# Altium schematic sheet breeze_wireless.SchDoc: Breeze Quadcopter
size A4; Author: myyerrol; Organization: Team MicroDynamics; Address1: NWPU; Address2: Xi'an; Address3: Shannxi; Address4: China; Revision: V0.1; SheetNumber: 5; SheetTotal: 5
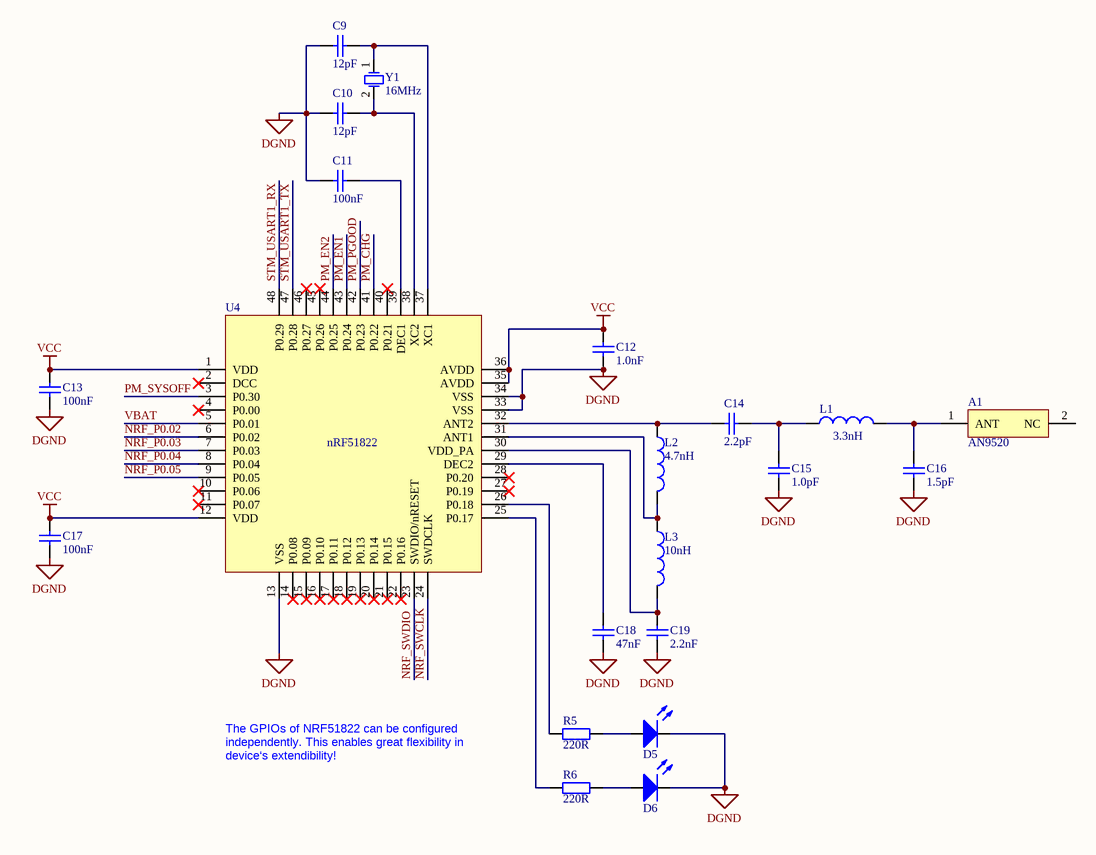
[diagram p0: breeze_wireless.SchDoc]

## Parts
A1  AN9520  [AN9520]
C9  value 12pF  [SMD-0603]  (hidden comment: CAP-0603)
C10  value 12pF  [SMD-0603]  (hidden comment: CAP-0603)
C11  value 100nF  [SMD-0603]  (hidden comment: CAP-0603)
C12  value 1.0nF  [SMD-0603]  (hidden comment: CAP-0603)
C13  value 100nF  [SMD-0603]  (hidden comment: CAP-0603)
C14  value 2.2pF  [SMD-0603]  (hidden comment: CAP-0603)
C15  value 1.0pF  [SMD-0603]  (hidden comment: CAP-0603)
C16  value 1.5pF  [SMD-0603]  (hidden comment: CAP-0603)
C17  value 100nF  [SMD-0603]  (hidden comment: CAP-0603)
C18  value 47nF  [SMD-0603]  (hidden comment: CAP-0603)
C19  value 2.2nF  [SMD-0603]  (hidden comment: CAP-0603)
D5  LED-0603  [SMD-0603]  (value not drawn)
D6  LED-0603  [SMD-0603]  (value not drawn)
L1  value 3.3nH  [SMD-0402]  (hidden comment: IND-0402)
L2  value 4.7nH  [SMD-0402]  (hidden comment: IND-0402)
L3  value 10nH  [SMD-0402]  (hidden comment: IND-0402)
R5  value 220R  [SMD-0603]  (hidden comment: RES-0603)
R6  value 220R  [SMD-0603]  (hidden comment: RES-0603)
U4  nRF51822  [QFN-48]
Y1  value 16MHz  [SMD-5032]  (hidden comment: XTAL-5032)

## Nets
DGND: C9.2 C10.2 C11.2 C12.2 C13.2 C15.2 C16.2 C17.2 C18.2 C19.2 D5.2(K) D6.2(K) U4.13(VSS) U4.33(VSS) U4.34(VSS)
VCC: C12.1 C13.1 C17.1 U4.1(VDD) U4.12(VDD) U4.35(AVDD) U4.36(AVDD)
NRF_P0.02: U4.6(P0.02)
NRF_P0.03: U4.7(P0.03)
NRF_P0.04: U4.8(P0.04)
NRF_P0.05: U4.9(P0.05)
NRF_SWCLK: U4.24(SWDCLK)
NRF_SWDIO: U4.23(SWDIO/nRESET)
PM_CHG: U4.41(P0.22)
PM_EN1: U4.43(P0.24)
PM_EN2: U4.44(P0.25)
PM_PGOOD: U4.42(P0.23)
PM_SYSOFF: U4.3(P0.30)
STM_USART1_RX: U4.48(P0.29)
STM_USART1_TX: U4.47(P0.28)
VBAT: U4.5(P0.01)
NetA1_1: A1.1(ANT) C16.1 L1.2
NetC9_1: C9.1 U4.37(XC1) Y1.1(OSC1)
NetC10_1: C10.1 U4.38(XC2) Y1.2(OSC2)
NetC11_1: C11.1 U4.39(DEC1)
NetC14_1: C14.1 L2.1 U4.32(ANT2)
NetC14_2: C14.2 C15.1 L1.1
NetC18_1: C18.1 U4.29(DEC2)
NetC19_1: C19.1 L3.2 U4.30(VDD_PA)
NetD5_1: D5.1(A) R5.2
NetD6_1: D6.1(A) R6.2
NetL2_2: L2.2 L3.1 U4.31(ANT1)
NetR5_1: R5.1 U4.26(P0.18)
NetR6_1: R6.1 U4.25(P0.17)

Not connected (* = marked no-connect by the designer): A1 2(NC); U4 2(DCC)* 4(P0.00)* 10(P0.06)* 11(P0.07)* 14(P0.08)* 15(P0.09)* 16(P0.10)* 17(P0.11)* 18(P0.12)* 19(P0.13)* 20(P0.14)* 21(P0.15)* 22(P0.16)* 27(P0.19)* 28(P0.20)* 40(P0.21)* 45(P0.26)* 46(P0.27)*

## Notes on the sheet
- The GPIOs of NRF51822 can be configured independently. This enables great flexibility in device‘s extendibility!
- Title
- Size:
- Date:
- A4
- Author:
- Time:
- Revision:
- Sheet
- of
- File:

## Library data of the parts
A1 = AN9520: 2.4GHz Wireless Communication Antenna
C9-C19 = CAP-0603: Capacitor
D5 D6 = LED-0603: LED
L1-L3 = IND-0402: Inductor
R5 R6 = RES-0603: Resistor
U4 = nRF51822: Multiprotocol Bluetooth 4.0 low energy/2.4 GHz RF SoC
Y1 = XTAL-5032: Passive Crystal Oscillator